# EAGLE design amf_v2 - Copy (EAGLE 7.7.0)
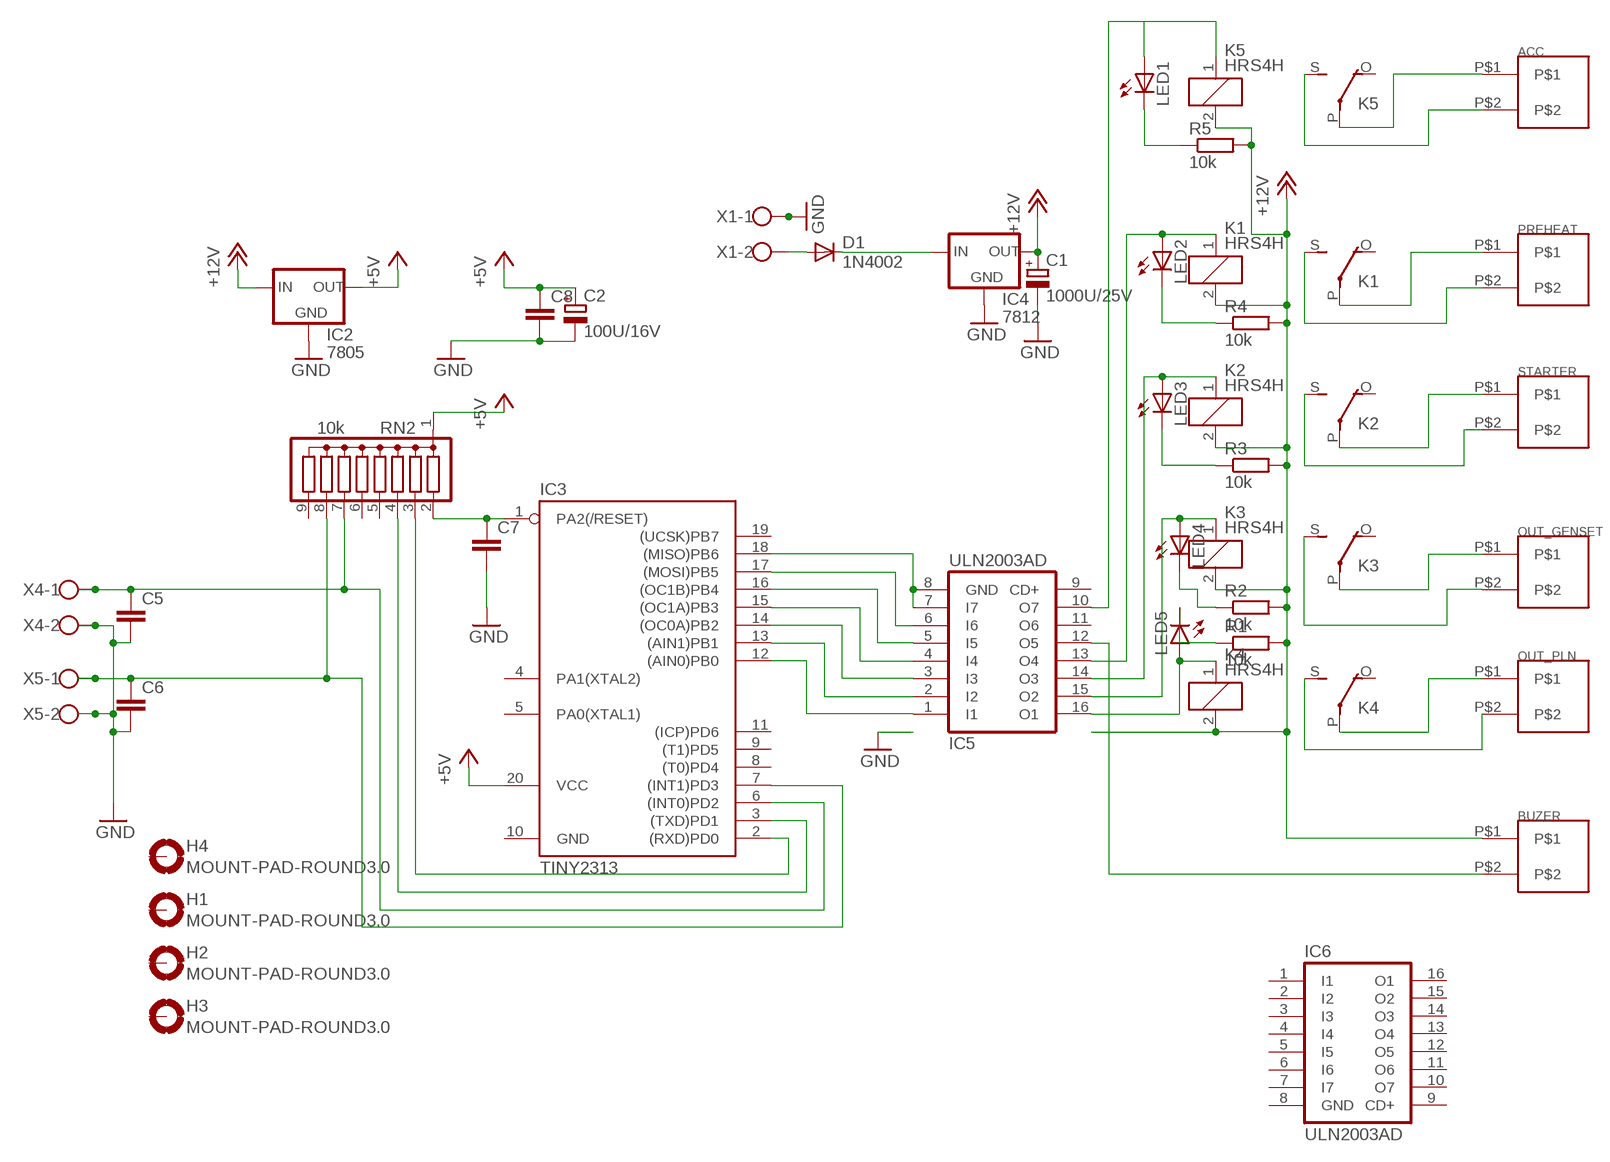
[diagram p0: schematic, sheet 1]

## Parts
ACC  TERMINAL-2U-5MM  [TERMINAL-2U-5MM]
BUZER  TERMINAL-2U-5MM  [TERMINAL-2U-5MM]
C1  1000U/25V  CPOL-EUE5-10.5  [E5-10,5]
C2  100U/16V  CPOL-EUE2.5-5  [E2,5-5]
C5  C-EU075-032X103  [C075-032X103]
C6  C-EU075-032X103  [C075-032X103]
C7  C-EU075-032X103  [C075-032X103]
C8  C-EU075-032X103  [C075-032X103]
D1  1N4002  1N4148DO35-10  [DO35-10]
H1  MOUNT-PAD-ROUND3.0  [3,0-PAD]
H2  MOUNT-PAD-ROUND3.0  [3,0-PAD]
H3  MOUNT-PAD-ROUND3.0  [3,0-PAD]
H4  MOUNT-PAD-ROUND3.0  [3,0-PAD]
IC2  7805  78XXS  [78XXS]
IC3  TINY2313  TINY2313-*P*  [DIL20]
IC4  7812  78XXS  [78XXS]
IC5  ULN2003AD  [SO16]
IC6  ULN2003AD  [SO16]
K1  HRS4H  ZF112  [ZF112]
K2  HRS4H  ZF112  [ZF112]
K3  HRS4H  ZF112  [ZF112]
K4  HRS4H  ZF112  [ZF112]
K5  HRS4H  ZF112  [ZF112]
LED1  LED5MM  [LED5MM]
LED2  LED5MM  [LED5MM]
LED3  LED5MM  [LED5MM]
LED4  LED5MM  [LED5MM]
LED5  LED5MM  [LED5MM]
OUT_GENSET  TERMINAL-2U-5MM  [TERMINAL-2U-5MM]
OUT_PLN  TERMINAL-2U-5MM  [TERMINAL-2U-5MM]
PREHEAT  TERMINAL-2U-5MM  [TERMINAL-2U-5MM]
R1  10k  R-EU_0204/2V  [0204V]
R2  10k  R-EU_0204/2V  [0204V]
R3  10k  R-EU_0204/2V  [0204V]
R4  10k  R-EU_0204/2V  [0204V]
R5  10k  R-EU_0204/2V  [0204V]
RN2  10k  G08R  [SIL9]
STARTER  TERMINAL-2U-5MM  [TERMINAL-2U-5MM]
X1  W237-102  [W237-102]
X4  W237-102  [W237-102]
X5  W237-102  [W237-102]

## Nets
+5V: C2.+ C8.1 IC2.OUT IC3.20(VCC) RN2.1
+12V: BUZER.P$1 C1.+ IC2.IN IC4.OUT K1.2 K2.2 K3.2 K4.2 K5.2 R1.2 R2.2 R3.2 R4.2 R5.2
GND: C1.- C2.- C5.2 C6.2 C7.2 C8.2 IC2.GND IC4.GND X1.1 X4.2 X5.2
N$1: D1.A X1.2
N$2: D1.C IC4.IN
N$3: IC5.16(O1) K4.1 LED5.A
N$4: IC5.15(O2) K3.1 LED4.A
N$5: IC5.14(O3) K2.1 LED3.A
N$6: IC5.13(O4) K1.1 LED2.A
N$7: IC3.12((AIN0)PB0) IC5.1(I1)
N$8: IC3.13((AIN1)PB1) IC5.2(I2)
N$9: IC3.14((OC0A)PB2) IC5.3(I3)
N$10: IC3.15((OC1A)PB3) IC5.4(I4)
N$11: IC3.16((OC1B)PB4) IC5.5(I5)
N$12: IC3.17((MOSI)PB5) IC5.6(I6)
N$13: IC3.18((MISO)PB6) IC5.7(I7) IC5.8(GND)
N$14: K4.P(2:P) OUT_PLN.P$1
N$15: K3.P(2:P) OUT_GENSET.P$1
N$16: K4.S(2:S) OUT_PLN.P$2
N$17: K3.S(2:S) OUT_GENSET.P$2
N$18: K2.P(2:P) STARTER.P$1
N$19: K2.S(2:S) STARTER.P$2
N$20: K1.P(2:P) PREHEAT.P$1
N$21: K1.S(2:S) PREHEAT.P$2
N$22: IC3.3((TXD)PD1) RN2.4
N$23: IC5.10(O7) K5.1 LED1.A
N$24: ACC.P$1 K5.P(2:P)
N$25: ACC.P$2 K5.S(2:S)
N$26: IC3.2((RXD)PD0) RN2.3
N$27: C7.1 IC3.1(PA2(/RESET)) RN2.2
N$28: C5.1 IC3.6((INT0)PD2) RN2.7 X4.1
N$29: C6.1 IC3.7((INT1)PD3) RN2.8 X5.1
N$31: BUZER.P$2 IC5.12(O5)
N$32: LED1.K(C) R5.1
N$33: LED2.K(C) R4.1
N$34: LED3.K(C) R3.1
N$35: LED4.K(C) R2.1
N$36: LED5.K(C) R1.1
Unconnected: H1.B3,0(MOUNT) H2.B3,0(MOUNT) H3.B3,0(MOUNT) H4.B3,0(MOUNT) IC3.4(PA1(XTAL2)) IC3.5(PA0(XTAL1)) IC3.8((T0)PD4) IC3.9((T1)PD5) IC3.11((ICP)PD6) IC3.19((UCSK)PB7) IC5.9(CD+) IC5.11(O6) IC6.1(I1) IC6.2(I2) IC6.3(I3) IC6.4(I4) IC6.5(I5) IC6.6(I6) IC6.7(I7) IC6.9(CD+) IC6.10(O7) IC6.11(O6) IC6.12(O5) IC6.13(O4) IC6.14(O3) IC6.15(O2) IC6.16(O1) K1.O(2:O) K2.O(2:O) K3.O(2:O) K4.O(2:O) K5.O(2:O) RN2.5 RN2.6 RN2.9

## Power pins joined to a net without a drawn wire
GND: IC3.10(GND) IC6.8(GND)

## Library data of the parts
ACC BUZER OUT_GENSET OUT_PLN PREHEAT STARTER = Itead_BP_110825.lbr:TERMINAL-2U-5MM: CON001
C1 C2 = resistor:CPOL-EU: POLARIZED CAPACITOR, European symbol
C5-C8 = resistor:C-EU: CAPACITOR, European symbol
D1 = diode:1N4148: DIODE high speed (Philips)
H1-H4 = holes:MOUNT-PAD-ROUND: MOUNTING PAD, round
IC2 IC4 = v-reg:78XXS: VOLTAGE REGULATOR
IC3 = avr-6:TINY2313*: Atmel Tiny2313 2K Flash, 128 bytes EEPROM, 128 bytes RAM
IC5 IC6 = uln-udn:ULN2003A: DRIVER ARRAY
K1-K5 = relay:ZF112: RELAY 1 x switch; OC_FARNELL: unknown; OC_NEWARK: unknown
LED1-LED5 = led:LED: LED OSRAM: - CHIPLED LG R971, LG N971, LY N971, LG Q971, LY Q971, LO R971, LY R971 LH N974, LH R974 LS Q976, LO Q976, LY Q976 LO Q996 - Hyper CHIPLED LW Q18S LB Q993, LB Q99A, LB R99A - SideLED LS A670, LO A670, LY A670, LG A670, LP A670 LB A673, LV A673, LT A673, LW A673 LH A674 LY A675 LS A676, LA A676, LO A676, LY A676, LW A676 LS A679, LY A679, LG A679 - Hyper Micro SIDELED® LS Y876, LA Y876, LO Y876, LY Y876 LT Y87S - SmartLED LW L88C, LW L88S LB L89C, LB L89S, LG L890 LS L89K, LO L89K, LY L89K LS L896, LA L896, LO L896, LY L896 - TOPLED LS T670, LO T670, LY T670, LG T670, LP T670 LSG T670, LSP T670, LSY T670, LOP T670, LYG T670 LG T671, LOG T671, LSG T671 LB T673, LV T673, LT T673, LW T673 LH T674 LS T676, LA T676, LO T676, LY T676, LB T676, LH T676, LSB T676, LW T676 LB T67C, LV T67C, LT T67C, LS T67K, LO T67K, LY T67K, LW E67C LS E67B, LA E67B, LO E67B, LY E67B, LB E67C, LV E67C, LT E67C LW T67C LS T679, LY T679, LG T679 LS T770, LO T770, LY T770, LG T770, LP T770 LB T773, LV T773, LT T773, LW T773 LH T774 LS E675, LA E675, LY E675, LS T675 LS T776, LA T776, LO T776, LY T776, LB T776 LHGB T686 LT T68C, LB T68C - Hyper Mini TOPLED® LB M676 - Mini TOPLED Santana® LG M470 LS M47K, LO M47K, LY M47K Source: http://www.osram.convergy.de LUXEON: - LUMILED® LXK2-PW12-R00, LXK2-PW12-S00, LXK2-PW14-U00, LXK2-PW14-V00 LXK2-PM12-R00, LXK2-PM12-S00, LXK2-PM14-U00 LXK2-PE12-Q00, LXK2-PE12-R00, LXK2-PE12-S00, LXK2-PE14-T00, LXK2-PE14-U00 LXK2-PB12-K00, LXK2-PB12-L00, LXK2-PB12-M00, LXK2-PB14-N00, LXK2-PB14-P00, LXK2-PB14-Q00 LXK2-PR12-L00, LXK2-PR12-M00, LXK2-PR14-Q00, LXK2-PR14-R00 LXK2-PD12-Q00, LXK2-PD12-R00, LXK2-PD12-S00 LXK2-PH12-R00, LXK2-PH12-S00 LXK2-PL12-P00, LXK2-PL12-Q00, LXK2-PL12-R00 Source: www.luxeon.com KINGBRIGHT: KA-3528ASYC Source: www.kingbright.com
R1-R5 = resistor:R-EU_: RESISTOR, European symbol
RN2 = resistor-sil:G08R: SIL RESISTOR; OC_FARNELL: unknown; OC_NEWARK: unknown
X1 X4 X5 = con-wago-500:W237-102: WAGO SCREW CLAMP; MPN: 237-102; OC_FARNELL: unknown; OC_NEWARK: 70K9898

## Board
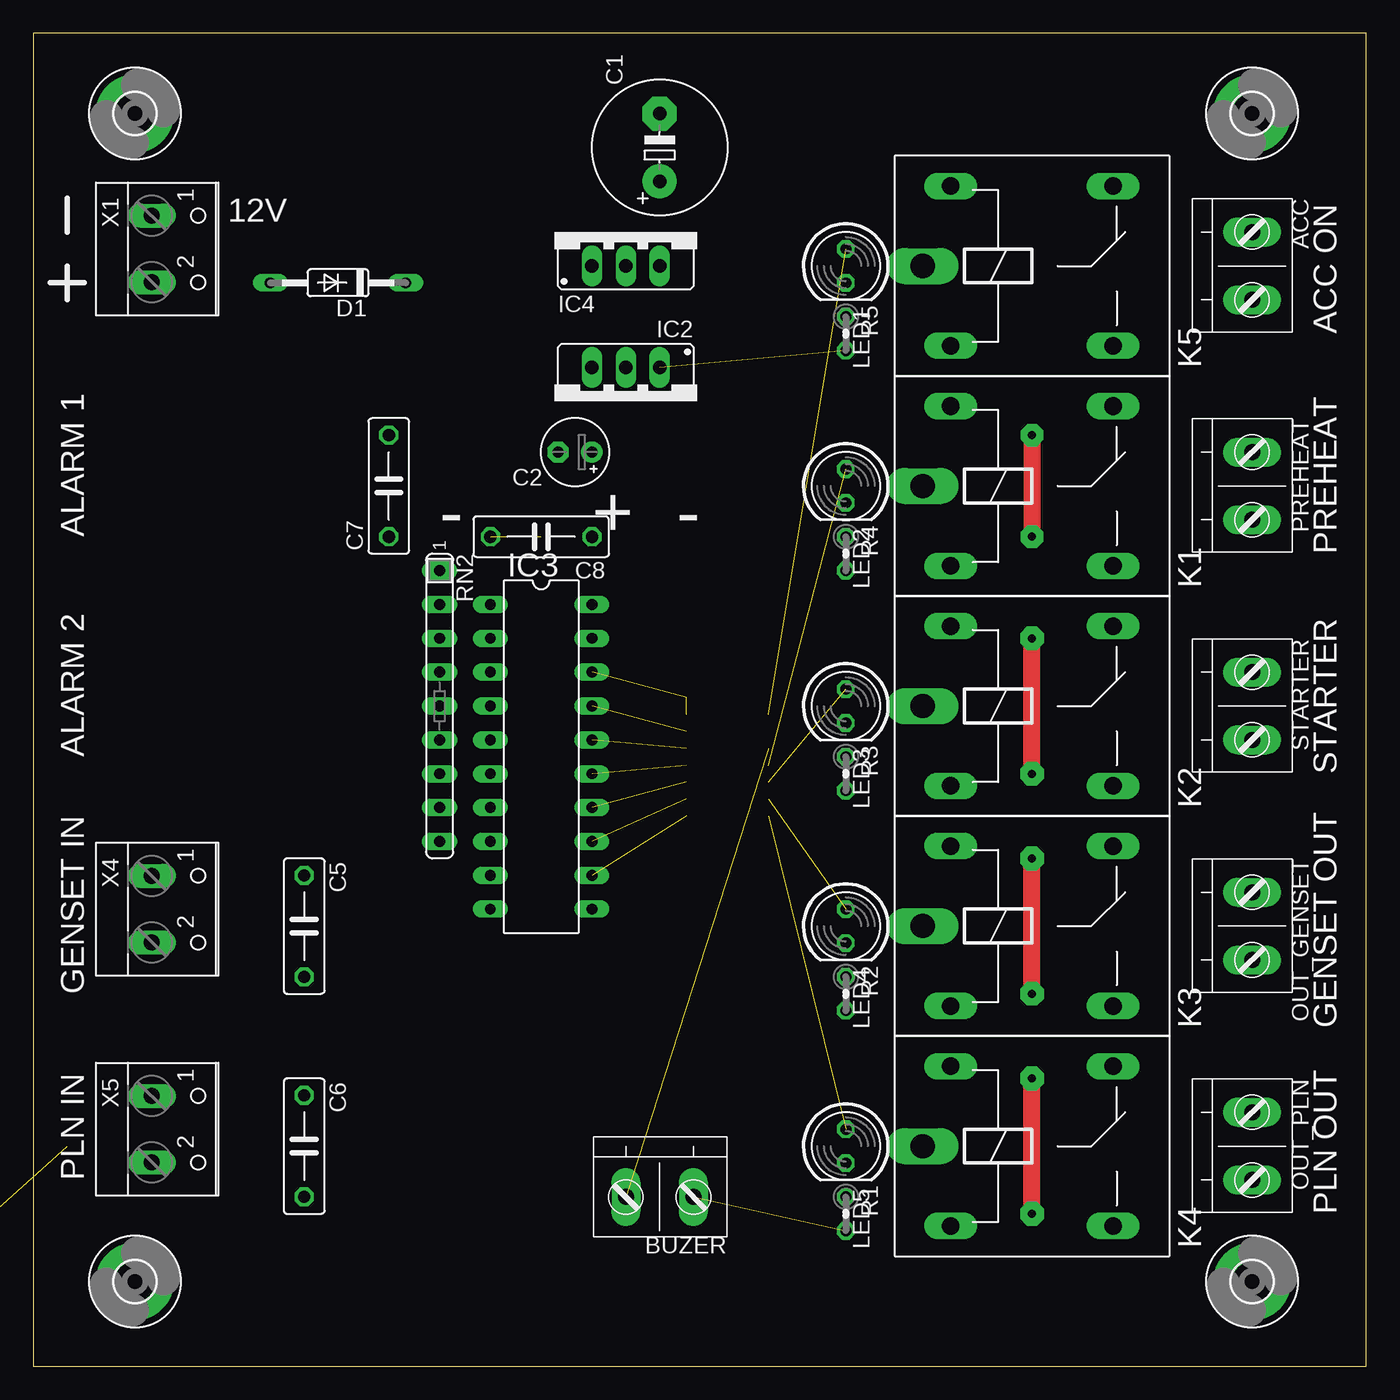
[diagram p1: board, top side]
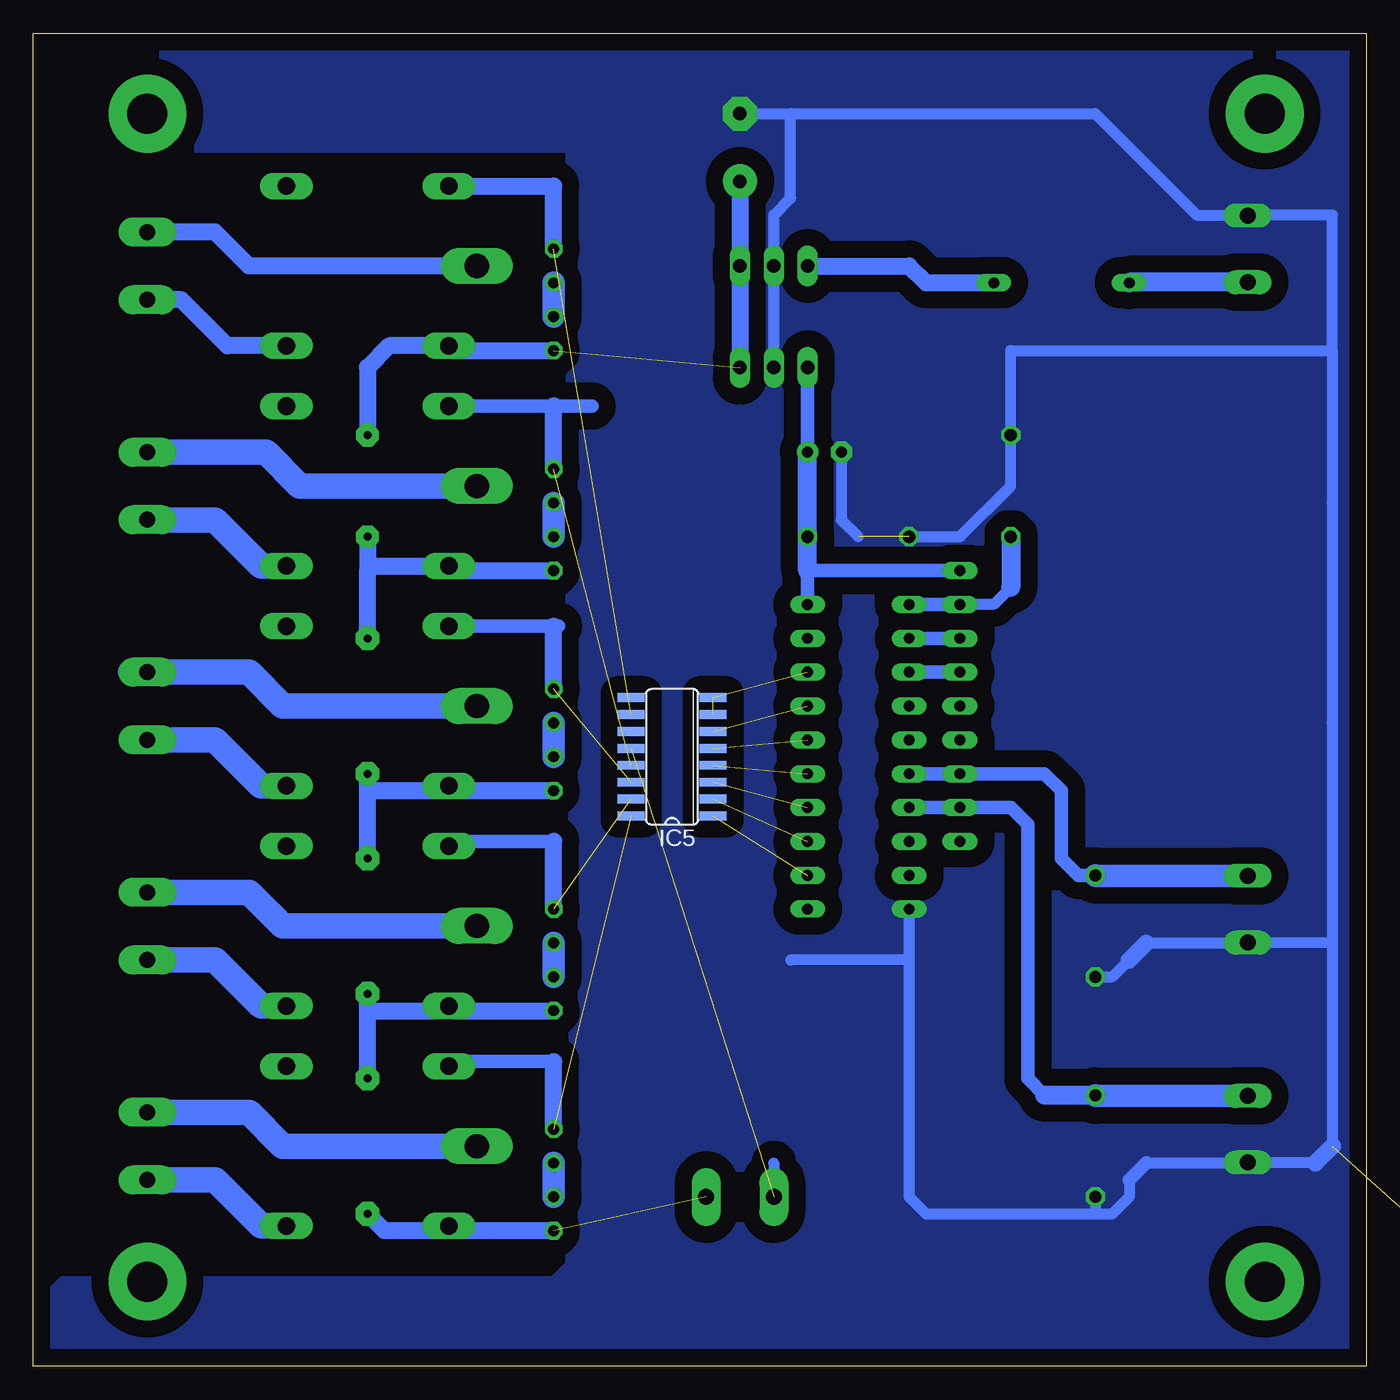
[diagram p2: board, bottom side, seen from below]

Size 100 x 100 mm. Coordinates in mm from the lower left corner, seen from the top.
Outline: 0,0 100,0 100,100 0,100 0,0
Copper layers (1*16): Top 0.035mm / dielectric 1.5mm / Bottom 0.035mm
Design rules "default": minimum track width 10mil, minimum drill 24mil, track to track 8mil, track to pad 8mil, pad to pad 8mil, via to via 8mil, smd to smd 8mil, copper to edge 40mil, drill to drill 8mil, minimum pad ring 10mil, minimum via ring 8mil, stop-mask expansion 4mil, vias tented up to drill 0mil, thermal gap 10mil

### Footprints (pad centres in the part's own frame; a part is rotated, then mirrored left to right if it is on the bottom)
TERMINAL-2U-5MM = drill 1.2 pad 2.184 long: P$1 2.54,5.08; P$2 7.62,5.08
E5-10,5 = drill 1.016 pad 2.54: + -2.54,0 | drill 1.016 pad 2.54 octagon: - 2.54,0
E2,5-5 = drill 0.813 pad 1.6: + -1.27,0 | drill 0.813 pad 1.6 octagon: - 1.27,0
C075-032X103 = drill 0.914 octagon: 1 -3.81,0; 2 3.81,0
DO35-10 = drill 0.813 long: A 5.08,0; C -5.08,0
3,0-PAD = drill 3 pad 5.842: B3,0 0,0
78XXS = drill 1.016 long: GND 0,-2.54; IN -2.54,-2.54; OUT 2.54,-2.54
DIL20 = drill 0.813 long: 1 -11.43,-3.81; 2 -8.89,-3.81; 3 -6.35,-3.81; 4 -3.81,-3.81; 5 -1.27,-3.81; 6 1.27,-3.81; 7 3.81,-3.81; 8 6.35,-3.81; 9 8.89,-3.81; 10 11.43,-3.81; 11 11.43,3.81; 12 8.89,3.81; 13 6.35,3.81; 14 3.81,3.81; 15 1.27,3.81; 16 -1.27,3.81; 17 -3.81,3.81; 18 -6.35,3.81; 19 -8.89,3.81; 20 -11.43,3.81
SO16 = smd 0.66 x 2.032: 1 -4.445,-3.073; 2 -3.175,-3.073; 3 -1.905,-3.073; 4 -0.635,-3.073; 5 0.635,-3.073; 6 1.905,-3.073; 7 3.175,-3.073; 8 4.445,-3.073; 9 4.445,3.073; 10 3.175,3.073; 11 1.905,3.073; 12 0.635,3.073; 13 -0.635,3.073; 14 -1.905,3.073; 15 -3.175,3.073; 16 -4.445,3.073
ZF112 = drill 1.321 long: 1 -6.096,5.994; 2 -6.096,-5.994; O 6.096,5.994; S 6.096,-5.994 | drill 1.803 long: P -8.204,0
LED5MM = drill 0.813 octagon: A -1.27,0; K 1.27,0
0204V = drill 0.813 octagon: 1 -1.27,0; 2 1.27,0
SIL9 = drill 0.813 long: 1 -10.16,0; 2 -7.62,0; 3 -5.08,0; 4 -2.54,0; 5 0,0; 6 2.54,0; 7 5.08,0; 8 7.62,0; 9 10.16,0
W237-102 = drill 1.194 long: 1 -2.5,-1.27; 2 2.5,-1.27

### Placement (x,y rotation side)
ACC  86.36,87.63 270 top
BUZER  52.07,17.78 180 top
C1  46.99,91.44 90 top
C2  40.64,68.58 180 top
C5  20.32,33.02 270 top
C6  20.32,16.51 270 top
C7  26.67,66.04 90 top
C8  38.1,62.23 180 top
D1  22.86,81.28 180 top
H1  7.62,6.35 0 top
H2  7.62,93.98 0 top
H3  91.44,93.98 0 top
H4  91.44,6.35 0 top
IC2  44.45,72.39 180 top
IC3  38.1,45.72 270 top
IC4  44.45,85.09 0 top
IC5  52.07,45.72 90 bottom
IC6  -40.64,-15.24 0 top  (outside the outline)
K1  74.93,66.04 0 top
K2  74.93,49.53 0 top
K3  74.93,33.02 0 top
K4  74.93,16.51 0 top
K5  74.93,82.55 0 top
LED1  60.96,82.55 270 top
LED2  60.96,66.04 270 top
LED3  60.96,49.53 270 top
LED4  60.96,33.02 270 top
LED5  60.96,16.51 270 top
OUT_GENSET  86.36,38.1 270 top
OUT_PLN  86.36,21.59 270 top
PREHEAT  86.36,71.12 270 top
R1  60.96,11.43 270 top
R2  60.96,27.94 270 top
R3  60.96,44.45 270 top
R4  60.96,60.96 270 top
R5  60.96,77.47 270 top
RN2  30.48,49.53 270 top
STARTER  86.36,54.61 270 top
X1  10.16,83.82 270 top
X4  10.16,34.29 270 top
X5  10.16,17.78 270 top

### Tracks (layer width: path | path; a pad name or v marks a point on that pad's centre or on a via)
+5V
  Bottom 1.016: RN2.1 41.91,59.69 IC3.20 | C2.+ IC2.OUT
  Bottom 1.422: 41.91,59.69 C8.1 C2.+
+12V  (via drill 0.6 pad 1.68, 0.6 pad 1.78)  (2 unrouted)
  Top 1.27: v74.93,44.45 v74.93,54.61 | v74.93,27.94 v74.93,38.1 | v74.93,11.43 v74.93,21.59 | v74.93,69.85 v74.93,62.23
  Bottom 1.016: K4.2 68.48,10.16 R1.2
  Bottom 1.27: 74.93,43.18 v74.93,44.45 | 74.93,43.18 69.19,43.18 K2.2 68.83,43.43 68.58,43.18 R3.2 | 74.93,26.67 69.85,26.67 69.49,27.03 K3.2 68.83,26.92 68.58,26.67 R2.2 | 74.93,26.67 v74.93,27.94 | v74.93,38.1 74.93,43.18 | v74.93,11.43 73.66,10.16 69.85,10.16 69.49,10.52 K4.2 68.58,10.26 68.58,10.16 R1.2 | v74.93,21.59 74.93,26.67 | v74.93,54.61 74.93,59.69 | 74.93,59.69 74.57,60.05 K1.2 68.48,59.69 R4.2 | v74.93,69.85 74.93,74.93 73.3,76.56 K5.2 68.83,76.45 68.58,76.2 R5.2 | v74.93,62.23 74.93,59.69 | C1.+ IC4.OUT IC2.IN
GND  (2 unrouted)
  Bottom 0.813: C2.- 39.37,63.5 38.1,62.23 | 2.54,76.2 26.67,76.2 C7.2 26.67,66.04 30.48,62.23 C8.2 | 2.54,76.2 2.54,86.36 8.85,86.36 X1.1 12.66,86.32 20.32,93.98 43.18,93.98 | 2.54,76.2 2.54,64.77 | 2.54,64.77 2.54,48.26 | 2.54,48.26 2.54,31.75 | 34.29,30.48 34.29,12.7 33.02,11.43 20.32,11.43 | 20.32,11.43 19.05,11.43 17.78,12.7 17.78,13.97 | IC3.10 34.29,30.48 | 34.29,30.48 43.18,30.48 | IC2.GND IC4.GND 44.45,86.36 43.18,87.63 43.18,93.98 | C1.- 43.18,93.98 | 17.78,30.48 19.05,29.21 C5.2 | C6.2 20.32,11.43 | 2.58,64.81 2.54,64.77 | 2.58,48.3 2.54,48.26 | 16.51,15.24 8.93,15.24 X5.2 3.85,15.28 3.81,15.24 | 2.54,31.75 8.85,31.75 | 8.85,31.75 X4.2 8.93,31.75 | 16.51,31.75 8.93,31.75 | 8.93,31.75 8.85,31.75 | 2.54,31.75 2.54,16.51
  Bottom 1.016: 16.51,15.24 17.78,13.97
  Bottom 1.27: 16.51,31.75 17.78,30.48 | 3.81,15.24 2.54,16.51
  pour Bottom (isolate 1.27, no thermals): 1.27,99.06 100.33,99.06 100.33,93.98 97.79,91.44 59.69,91.44 59.69,7.62 60.96,6.35 97.79,6.35 99.06,5.08 99.06,0 0,0
N$1
  Bottom 1.422: X1.2 17.78,81.32 D1.A
N$2
  Bottom 1.27: IC4.IN 34.29,82.55 33.02,81.28 D1.C
N$3  (1 unrouted)
  Bottom 1.016: 60.96,22.86 68.48,22.86 K4.1
  Bottom 1.27: LED5.A 60.96,22.86
N$4  (1 unrouted)
  Bottom 1.016: 60.96,39.37 68.48,39.37 K3.1
  Bottom 1.27: LED4.A 60.96,39.37
N$5  (1 unrouted)
  Bottom 1.016: 60.6,55.52 60.96,55.52 K2.1
  Bottom 1.27: LED3.A 60.96,55.52
N$6  (1 unrouted)
  Bottom 1.016: 58.06,72.03 60.96,72.03 K1.1
  Bottom 1.27: LED2.A 60.96,72.03
N$7  (1 unrouted)
N$8  (1 unrouted)
N$9  (1 unrouted)
N$10  (1 unrouted)
N$11  (1 unrouted)
N$12  (1 unrouted)
N$13  (2 unrouted)
N$14
  Bottom 1.93: K4.P 81.28,16.51 83.82,19.05 OUT_PLN.P$1
N$15
  Bottom 1.93: K3.P 81.28,33.02 83.82,35.56 OUT_GENSET.P$1
N$16
  Bottom 1.93: K4.S 82.91,10.52 86.36,13.97 OUT_PLN.P$2
N$17
  Bottom 1.93: K3.S 82.91,27.03 86.36,30.48 OUT_GENSET.P$2
N$18
  Bottom 1.93: K2.P 81.28,49.53 83.82,52.07 STARTER.P$1 92.71,52.07
N$19
  Bottom 1.93: K2.S 82.91,43.54 86.36,46.99 STARTER.P$2
N$20
  Bottom 1.93: K1.P 80.01,66.04 82.55,68.58 PREHEAT.P$1
N$21
  Bottom 1.93: K1.S 82.91,60.05 86.36,63.5 PREHEAT.P$2
N$22
  Bottom 1.016: RN2.4 IC3.3
N$23  (1 unrouted)
  Bottom 1.27: K5.1 60.96,88.54 LED1.A
N$24
  Bottom 1.27: K5.P 83.82,82.55 86.36,85.09 ACC.P$1
N$25
  Bottom 1.27: K5.S 85.45,76.56 88.9,80.01 ACC.P$2 92.71,80.01
N$26
  Bottom 1.016: RN2.3 IC3.2
N$27
  Bottom 0.813: 26.67,58.42 27.94,57.15 RN2.2
  Bottom 1.016: RN2.2 IC3.1
  Bottom 1.422: C7.1 26.67,58.42
N$28
  Bottom 1.016: IC3.6 RN2.7 24.13,44.45 22.86,43.18 22.86,38.1 21.59,36.83 C5.1
  Bottom 1.676: X4.1 20.28,36.79 C5.1
N$29
  Bottom 1.016: IC3.7 RN2.8 26.67,41.91 25.4,40.64 25.4,21.59 24.13,20.32
  Bottom 1.422: C6.1 24.13,20.32
  Bottom 1.676: X5.1 20.28,20.28 C6.1
N$31  (1 unrouted)
  Bottom 0.813: 44.45,15.24 BUZER.P$2
N$32
  Bottom 1.676: LED1.K R5.1
N$33
  Bottom 1.676: LED2.K R4.1
N$34
  Bottom 1.676: LED3.K R3.1
N$35
  Bottom 1.676: LED4.K R2.1
N$36
  Bottom 1.676: R1.1 LED5.K

### Text on the board
tPlace: 12V | ACC ON | ALARM 1 | - | + | - | PREHEAT | ALARM 2 | STARTER | GENSET IN | GENSET OUT | PLN IN | PLN OUT